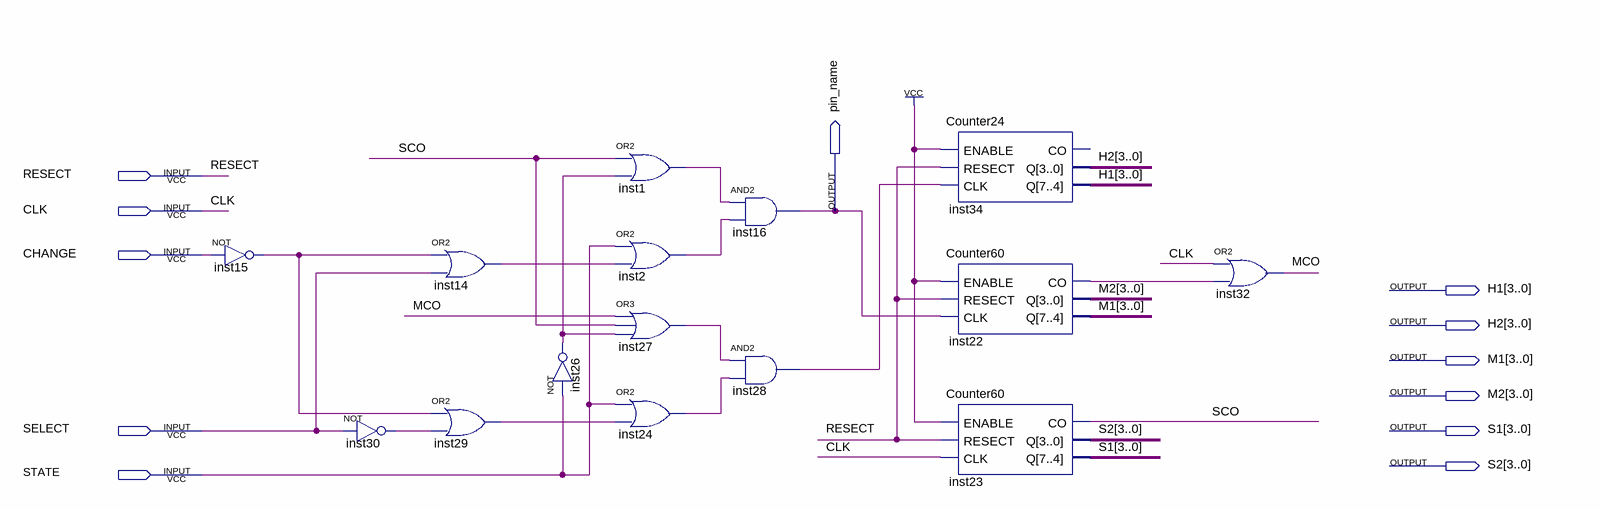
[diagram p0: schematic sheet]
// Quartus schematic TimeModule.bdf as structural Verilog: 15 symbols, 12 pins
module TimeModule (
  input  RESECT,
  input  CLK,
  input  CHANGE,
  input  SELECT,
  input  STATE,
  output pin_name,
  output [3:0] H1,
  output [3:0] H2,
  output [3:0] M1,
  output [3:0] M2,
  output [3:0] S1,
  output [3:0] S2
);

  wire inst1_out, inst2_out, inst14_out, inst15_out, inst22_co, inst24_out, inst26_out, inst27_out,
       inst28_out, inst29_out, inst30_out, MCO, SCO;

  not inst15 (inst15_out, CHANGE);
  not inst30 (inst30_out, SELECT);
  or inst14 (inst14_out, inst15_out, SELECT);
  or inst29 (inst29_out, inst15_out, inst30_out);
  not inst26 (inst26_out, STATE);
  or inst1 (inst1_out, SCO, inst26_out);
  or inst2 (inst2_out, STATE, inst14_out);
  or inst27 (inst27_out, MCO, SCO, inst26_out);
  or inst24 (inst24_out, STATE, inst29_out);
  and inst16 (pin_name, inst1_out, inst2_out);
  and inst28 (inst28_out, inst27_out, inst24_out);
  Counter24 inst34 (.ENABLE(1'b1), .RESECT(RESECT), .CLK(inst28_out), .Q({H1, H2}));  // open: CO
  Counter60 inst22 (.ENABLE(1'b1), .RESECT(RESECT), .CLK(pin_name), .CO(inst22_co), .Q({M1, M2}));
  Counter60 inst23 (.ENABLE(1'b1), .RESECT(RESECT), .CLK(CLK), .CO(SCO), .Q({S1, S2}));
  or inst32 (MCO, CLK, inst22_co);
endmodule
